# EAGLE design photon (EAGLE 6.5.0)
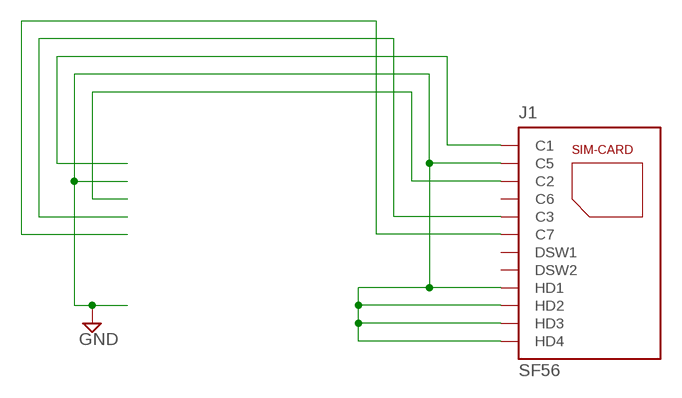
[diagram p0: schematic, sheet 1]

## Parts
J1  SF56  [JAE]

## Nets
C1: J1.C1
C2: J1.C2
C3: J1.C3
C7: J1.C7
GND: J1.C5 J1.HD1 J1.HD2 J1.HD3 J1.HD4
Unconnected: J1.C6 J1.DSW1 J1.DSW2

## Library data of the parts
J1 = sim:SF56: JAE Micro SIM Push Pull Slot SF56S006V4B

## Board
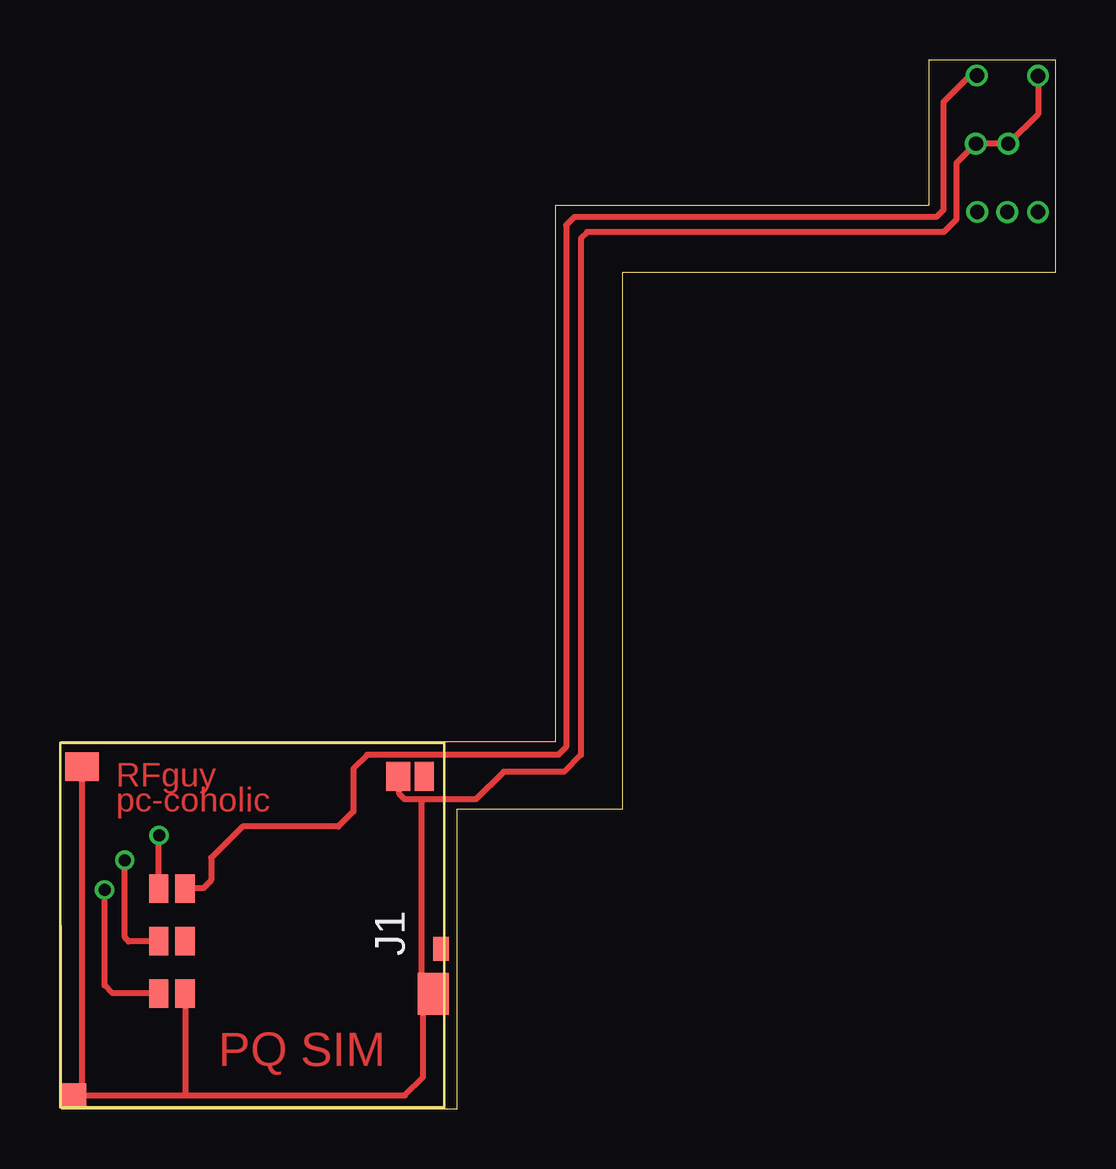
[diagram p1: board, top side]
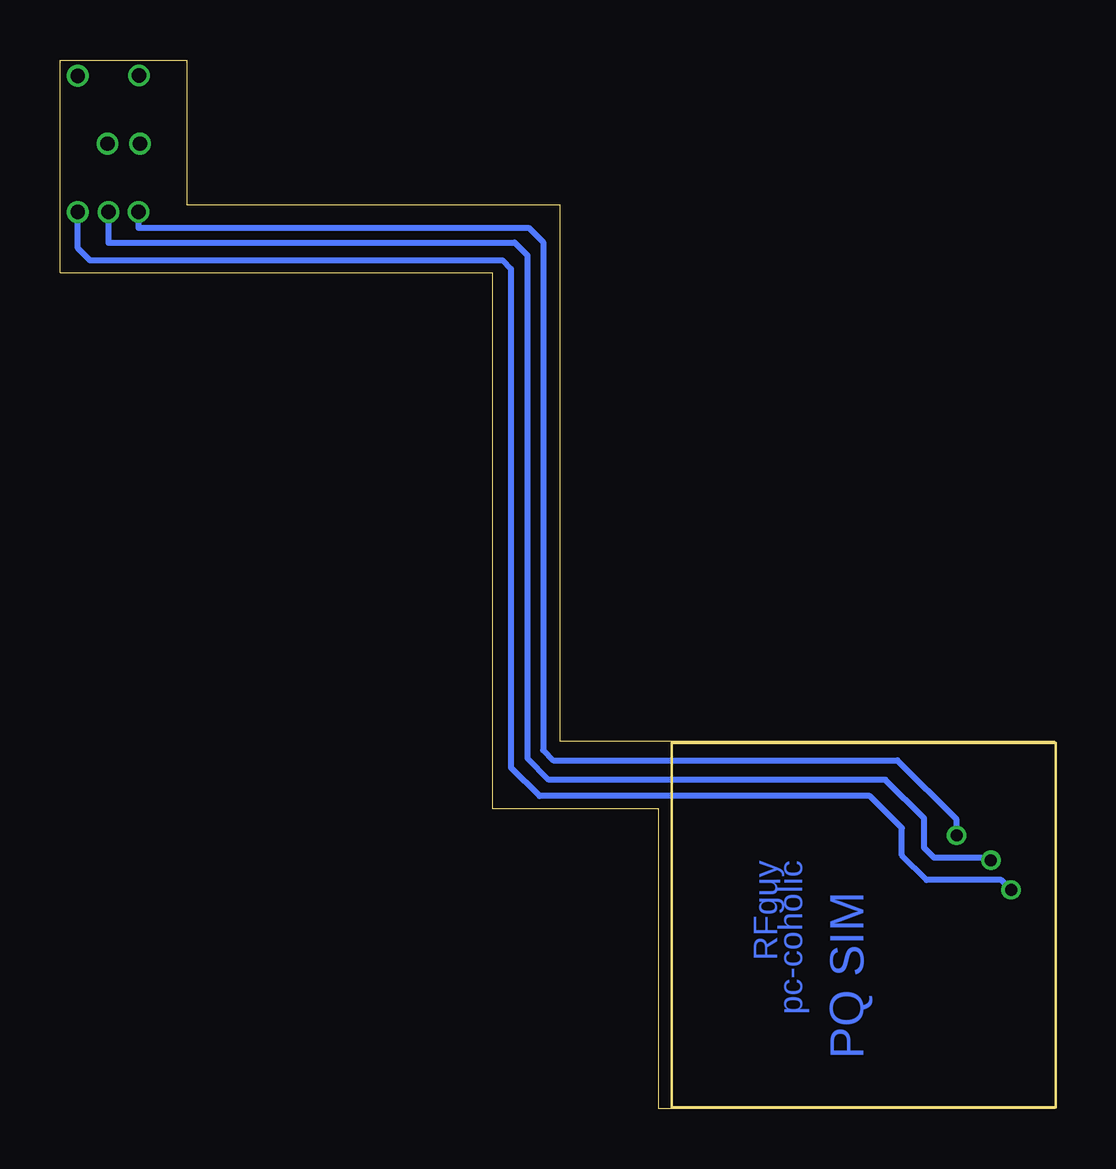
[diagram p2: board, bottom side, seen from below]

Size 41.49 x 43.71 mm. Coordinates in mm from the lower left corner, seen from the top.
Outline: 0.04,15.31 0.05,0 16.55,0 16.55,12.5 23.45,12.5 23.45,34.84 41.49,34.84 41.49,43.71 36.2,43.71 36.2,37.65 20.65,37.65 20.65,15.3 0.04,15.31
Copper layers (1*16): Top 0.035mm / dielectric 1.5mm / Bottom 0.035mm
Design rules "ITEADstudio_DRC": minimum track width 6mil, minimum drill 12mil, track to track 6mil, track to pad 6mil, pad to pad 6mil, via to via 6mil, smd to smd 0mil, copper to edge 10mil, drill to drill 10mil, minimum pad ring 10mil, minimum via ring 6mil, stop-mask expansion 2mil, vias tented up to drill 100mil, thermal gap 10mil
tRestrict: area 40.4,37 to 41.1,37.7; area 37.8,39.9 to 38.5,40.6; area 39.2,39.9 to 39.8,40.6; area 37.9,42.7 to 38.5,43.4; area 40.4,42.7 to 41.1,43.4; area 37.9,37 to 38.6,37.7; area 39.1,37 to 39.8,37.7
bRestrict: area 39.2,39.9 to 39.8,40.5; area 37.9,37 to 38.6,37.7; area 39.1,37 to 39.8,37.7; area 40.4,37 to 41.1,37.7; area 37.9,42.7 to 38.5,43.4; area 40.4,42.7 to 41.1,43.4; area 37.8,39.9 to 38.5,40.6

### Footprints (pad centres in the part's own frame; a part is rotated, then mirrored left to right if it is on the bottom)
JAE = smd 1.2 x 0.8: C1 2.86,-11.89; C2 0.67,-11.89; C3 -1.52,-11.89; C5 2.86,-10.79; C6 0.67,-10.79; C7 -1.52,-10.79; DSW1 -6.2,-0.82 | smd 1 x 0.65: DSW2 1,-0.12 | smd 1.2 x 1.4: HD1 -6.6,-15.09 | smd 1.2 x 1: HD2 -6.2,-1.9 | smd 1.75 x 1.3: HD3 2.87,-0.45 | smd 1 x 1.1: HD4 7.1,-15.45

### Placement (x,y rotation side)
J1  16,7.65 270 top

### Tracks (layer width: path | path; a pad name or v marks a point on that pad's centre or on a via)
C1  (via drill 0.5, 0.6)
  Top 0.254: J1.C1 4.09,4.81 2.18,4.81 1.86,5.13 v1.86,9.12
  Bottom 0.254: 40.75,36.95 v40.75,37.37 40.75,35.86 40.25,35.36 23.05,35.36 22.7,35.01 22.7,14.22 21.51,13.03 7.75,13.03 6.41,11.69 6.41,10.56 5.38,9.53 2.27,9.53 v1.86,9.12
C2  (via drill 0.5, 0.6)
  Top 0.254: J1.C2 2.86,6.97 2.7,7.13 v2.7,10.35
  Bottom 0.254: v39.47,37.37 39.47,36.09 38.69,36.09 22.55,36.1 22.02,35.57 22.02,14.61 21.12,13.71 7.1,13.71 5.49,12.1 5.49,10.87 5.07,10.45 2.8,10.45 v2.7,10.35
C3  (via drill 0.5, 0.6)
  Top 0.254: J1.C3 4.11,11.37 v4.13,11.39
  Bottom 0.254: v38.22,37.38 38.22,36.72 21.96,36.72 21.36,36.12 21.36,14.94 20.94,14.52 6.6,14.52 4.13,12.05 v4.13,11.39
C7  (via drill 0.6)
  Top 0.254: v38.2,43.07 37.93,43.07 36.81,41.95 36.81,37.46 36.51,37.16 21.43,37.16 21.09,36.82 21.09,15.07 20.77,14.75 12.8,14.75 12.22,14.17 12.22,12.38 11.6,11.76 7.61,11.76 6.3,10.45 6.3,9.52 5.96,9.18 J1.C7
GND  (via drill 0.6)
  Top 0.254: v40.75,43.05 40.75,41.46 v39.51,40.22 v38.16,40.22 37.35,39.41 37.35,37.06 36.83,36.54 21.96,36.54 21.7,36.28 21.7,14.74 21,14.04 18.48,14.04 17.33,12.89 15.17,12.89 | 15.17,12.89 14.36,12.89 14.14,13.11 14.14,13.81 J1.HD2 | 15.17,12.89 15.08,12.8 15.08,5.59 15.55,5.12 J1.HD3 15.13,4.36 15.13,1.31 14.37,0.55 5.15,0.55 | 5.15,0.55 J1.HD4 0.91,0.91 J1.HD1 | J1.C5 5.21,0.61 5.15,0.55

### Text on the board
Top: RFguy / pc-coholic | PQ SIM
Bottom: RFguy / pc-coholic | PQ SIM